# Altium schematic sheet MCU_CORE.SchDoc
size A2
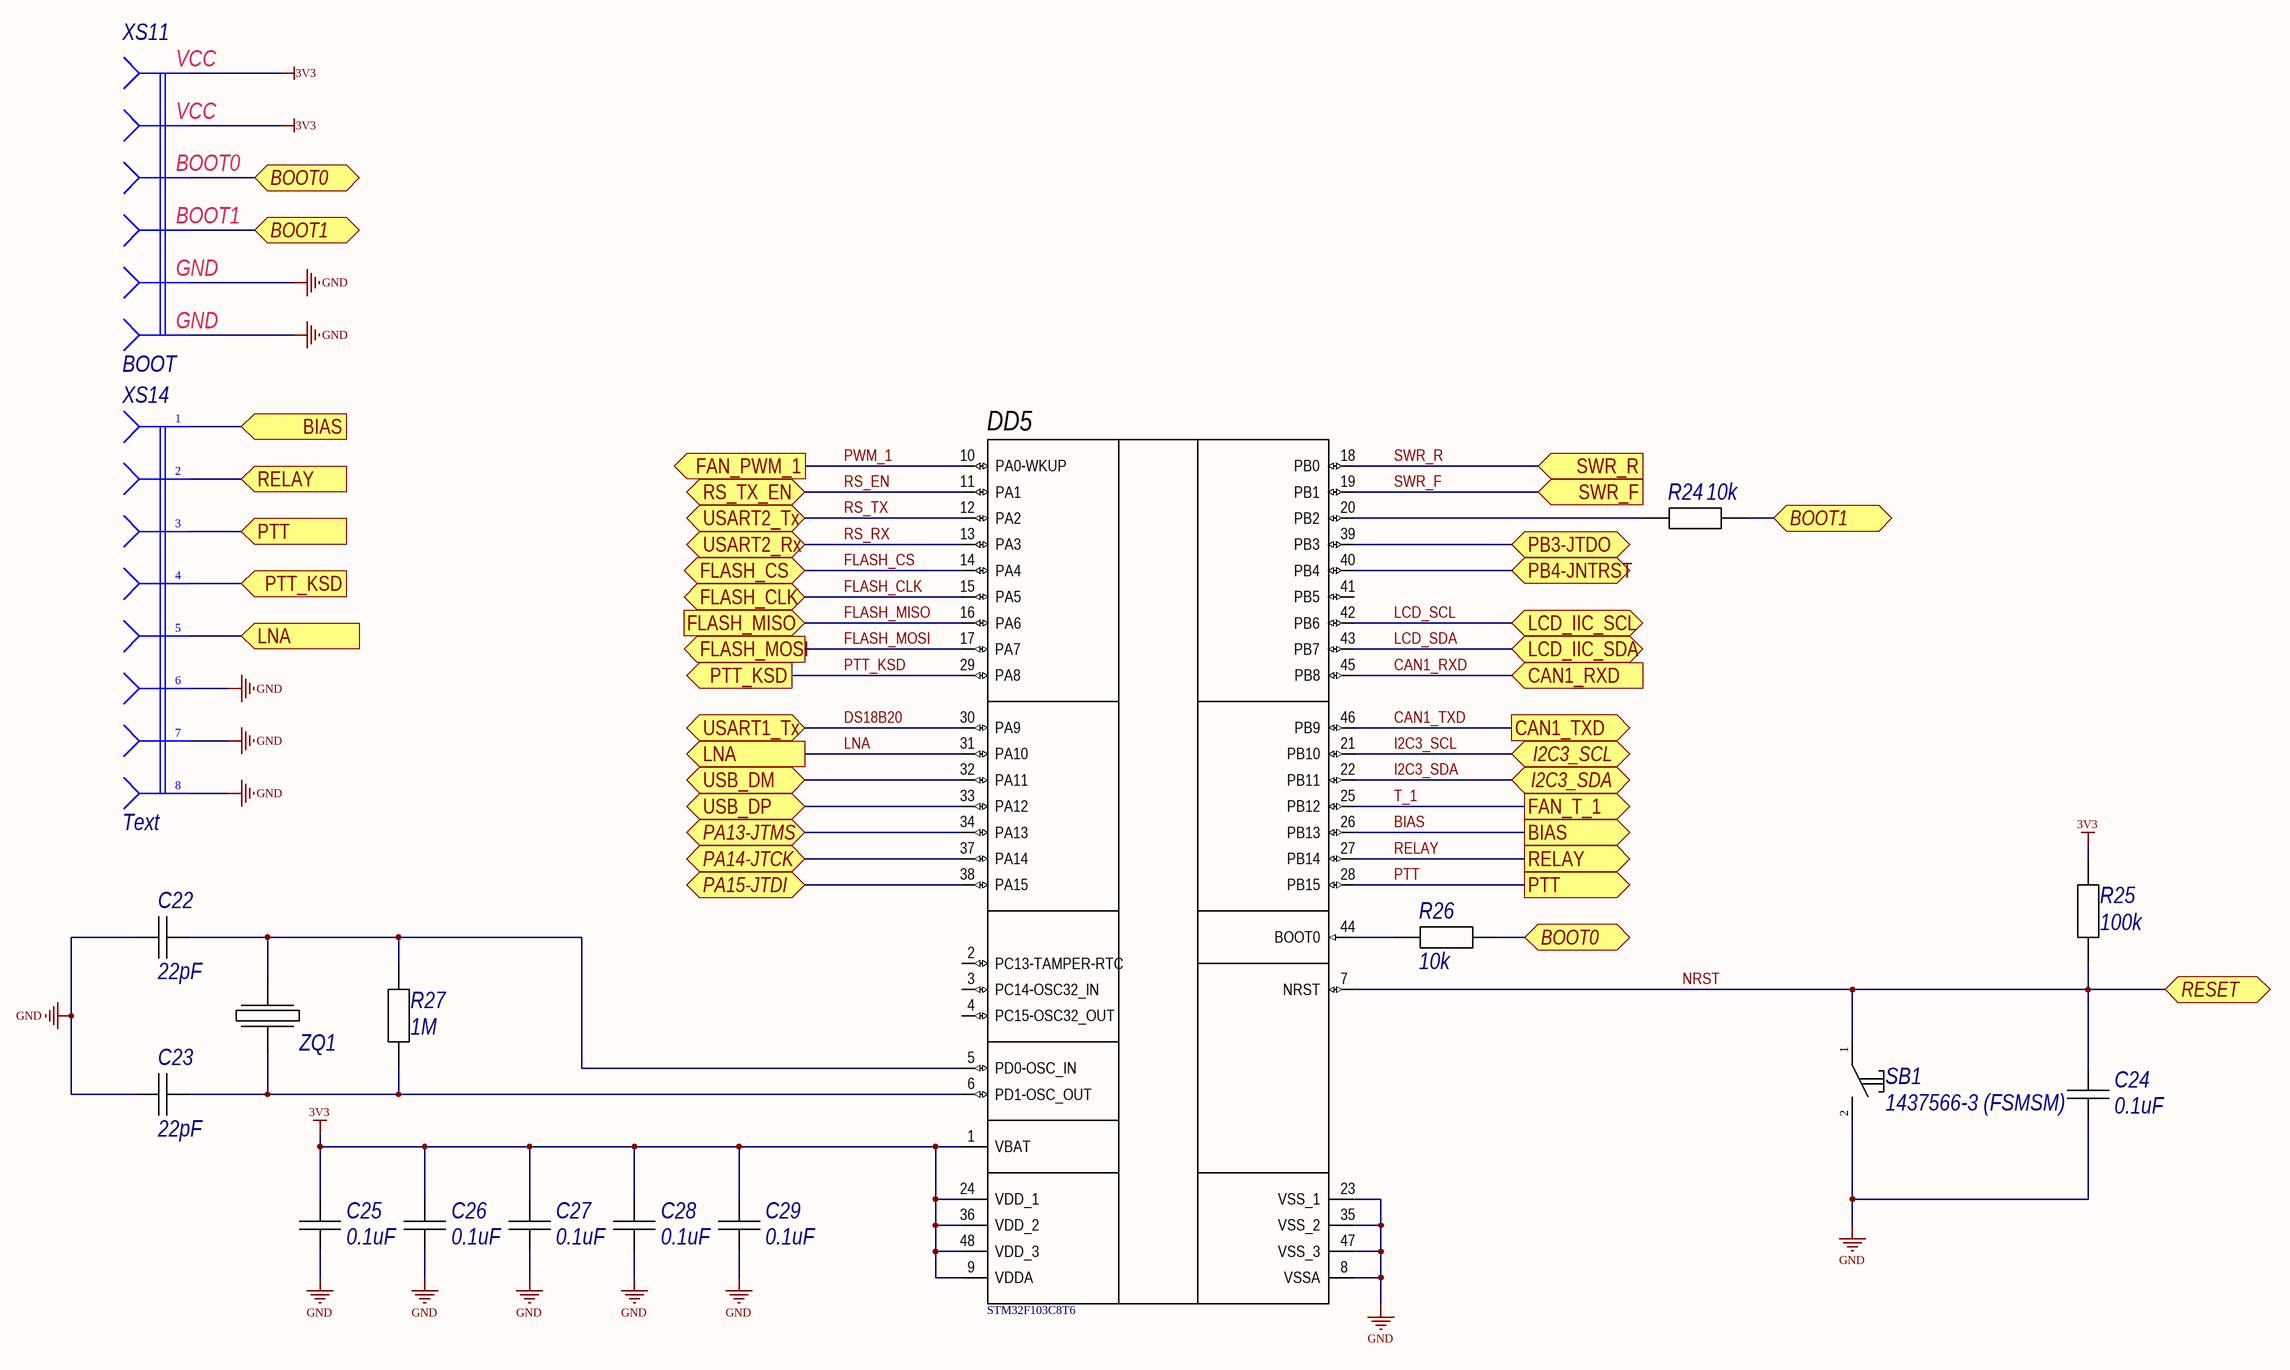
[diagram p0: MCU_CORE.SchDoc]

## Parts
C22  22pF  [C0805C]
C23  22pF  [C0805C]
C24  0.1uF  [C0805C]
C25  0.1uF  [C0805C]
C26  0.1uF  [C0805C]
C27  0.1uF  [C0805C]
C28  0.1uF  [C0805C]
C29  0.1uF  [C0805C]
DD5  STM32F103C8T6  [STM-LQFP48_L]
R24  10k  [C0805R]
R25  100k  [C0805R]
R26  10k  [C0805R]
R27  1M  [C0805R]
SB1  1437566-3 (FSMSM)  [1437566-3]
XS11  BOOT  [PLD2-3]
XS14  Text  [WF-8]
ZQ1  HC49SM  [HC49SM]  (value not drawn)

## Ports
BIAS (in), BIAS (out), BOOT0 (bidir), BOOT1 (bidir), CAN1_RXD (in), CAN1_TXD (out), FAN_PWM_1 (out), FAN_T_1 (out), FLASH_CLK (bidir), FLASH_CS (bidir), FLASH_MISO (in), FLASH_MOSI (out), I2C3_SCL (bidir), I2C3_SDA (bidir), LCD_IIC_SCL (bidir), LCD_IIC_SDA (bidir), LNA (in), LNA (out), PA13-JTMS (bidir), PA14-JTCK (bidir), PA15-JTDI (bidir), PB3-JTDO (bidir), PB4-JNTRST (bidir), PTT (in), PTT (out), PTT_KSD (in), PTT_KSD (out), RELAY (in), RELAY (out), RESET (bidir), RS_TX_EN (bidir), SWR_F (in), SWR_R (in), USART1_Tx (bidir), USART2_Rx (bidir), USART2_Tx (bidir), USB_DM (bidir), USB_DP (bidir)

## Nets
3V3: C25.2 C26.2 C27.2 C28.2 C29.2 DD5.1(VBAT) DD5.9(VDDA) DD5.24(VDD_1) DD5.36(VDD_2) DD5.48(VDD_3) R25.1 XS11.1 XS11.2
GND: C22.1 C23.1 C24.1 C25.1 C26.1 C27.1 C28.1 C29.1 DD5.8(VSSA) DD5.23(VSS_1) DD5.35(VSS_2) DD5.47(VSS_3) SB1.2 XS11.5 XS11.6 XS14.6 XS14.7 XS14.8
BIAS: DD5.26(PB13) XS14.1 ; port BIAS
BOOT0: R26.1 XS11.3 ; port BOOT0
BOOT1: R24.1 XS11.4 ; port BOOT1
CAN1_RXD: DD5.45(PB8) ; port CAN1_RXD
CAN1_TXD: DD5.46(PB9) ; port CAN1_TXD
DS18B20: DD5.30(PA9) ; port USART1_Tx
FLASH_CLK: DD5.15(PA5) ; port FLASH_CLK
FLASH_CS: DD5.14(PA4) ; port FLASH_CS
FLASH_MISO: DD5.16(PA6) ; port FLASH_MISO
FLASH_MOSI: DD5.17(PA7) ; port FLASH_MOSI
I2C3_SCL: DD5.21(PB10) ; port I2C3_SCL
I2C3_SDA: DD5.22(PB11) ; port I2C3_SDA
LCD_SCL: DD5.42(PB6) ; port LCD_IIC_SCL
LCD_SDA: DD5.43(PB7) ; port LCD_IIC_SDA
LNA: DD5.31(PA10) XS14.5 ; port LNA
NRST: C24.2 DD5.7(NRST) R25.2 SB1.1 ; port RESET
PA13-JTMS: DD5.34(PA13) ; port PA13-JTMS
PA14-JTCK: DD5.37(PA14) ; port PA14-JTCK
PA15-JTDI: DD5.38(PA15) ; port PA15-JTDI
PB3-JTDO: DD5.39(PB3) ; port PB3-JTDO
PB4-JNTRST: DD5.40(PB4) ; port PB4-JNTRST
PTT: DD5.28(PB15) XS14.3 ; port PTT
PTT_KSD: DD5.29(PA8) XS14.4 ; port PTT_KSD
PWM_1: DD5.10(PA0-WKUP) ; port FAN_PWM_1
RELAY: DD5.27(PB14) XS14.2 ; port RELAY
RS_EN: DD5.11(PA1) ; port RS_TX_EN
RS_RX: DD5.13(PA3) ; port USART2_Rx
RS_TX: DD5.12(PA2) ; port USART2_Tx
SWR_F: DD5.19(PB1) ; port SWR_F
SWR_R: DD5.18(PB0) ; port SWR_R
T_1: DD5.25(PB12) ; port FAN_T_1
USB_DM: DD5.32(PA11) ; port USB_DM
USB_DP: DD5.33(PA12) ; port USB_DP
NetC22_2: C22.2 DD5.5(PD0-OSC_IN) R27.2 ZQ1.1
NetC23_2: C23.2 DD5.6(PD1-OSC_OUT) R27.1 ZQ1.2
NetDD5_20: DD5.20(PB2) R24.2
NetDD5_44: DD5.44(BOOT0) R26.2

Not connected (* = marked no-connect by the designer): DD5 2(PC13-TAMPER-RTC) 3(PC14-OSC32_IN) 4(PC15-OSC32_OUT) 41(PB5)

## Notes on the sheet
- (in symbol CONNECT_BOOT) VCC; BOOT0; BOOT1; GND

## Library data of the parts
C22-C29 = CAP_0805: Type: Конденсатор; Published: 18.05.2010; Publisher: Andrew Danich
DD5 = STM32F103C8T6: ARM Cortex-M3 32-bit MCU, 64 KB Flash, 20 KB Internal RAM, 37 I/Os, 48-pin LQFP, -40 to 85 degC, Tray; A/D Converter: 2x12-bit (10 Channel); FLASH Size (Prog) (kB): 64; I/Os (High Current): 37; Internal RAM Size (kB): 20; Operating Frequency(F) (Processor speed) (MHz): 72; Supply Voltage(Vcc) min (V): 2; DatasheetVersion: Rev. 16; PackageVersion: Rev. 6, 06/2013; PackageReference: LQFP48; PackageDescription: 48-Pin Low Profile Quad Flat Package, 7 x 7 mm Body, 0.5 mm Pitch; Supplier 1: Digi-Key; Supplier Part Number 1: 497-6063-ND; Supplier 2: Farnell; Supplier Part Number 2: 1447637; Supplier 3: Newark; Supplier Part Number 3: 59M2182; Supplier 4: Newark; Supplier Part Number 4: 57P1222; Supplier 5: Mouser; Supplier Part Number 5: 511-STM32F103C8T6; Core: ARM Cortex-M3; Packing: Tray; Mounting Technology: Surface Mount; PartNumber: STM32F103C8T6; ComponentLink1Description: Manufacturer URL; ComponentLink1URL: http://www.st.com/web/en/home.html; ComponentLink2Description: Datasheet; ComponentLink2URL: http://www.st.com/st-web-ui/static/active/en/resource/technical/document/datasheet/CD00161566.pdf; ComponentLink3Description: Package Specification; ComponentLink3URL: http://www.st.com/st-web-ui/static/active/en/resource/technical/document/datasheet/DM00058181.pdf
R24-R27 = RES_0805: Published: 24.03.2010; Publisher: Andrew Danich; Type: Резистор
SB1 = BT-01x-01p: Published: 17.04.2014; Publisher: Andrew Danich; Type: Переключатель
XS11 = CONNECT_BOOT: Value: Connector; Published: 07.03.2013; Publisher: Andrew Danich; Type: Розетка
XS14 = Con-8-F: Value: Connector; Published: 07.03.2013; Publisher: Andrew Danich; Type: Розетка
ZQ1 = HC49SM: Published: 08.03.2013; Publisher: Andrew Danich; Type: Резонатор